# EAGLE design GFB_Basisstation (EAGLE 9.6.2)

## Sheet 1 of 3: Spannungsversorgung / USB
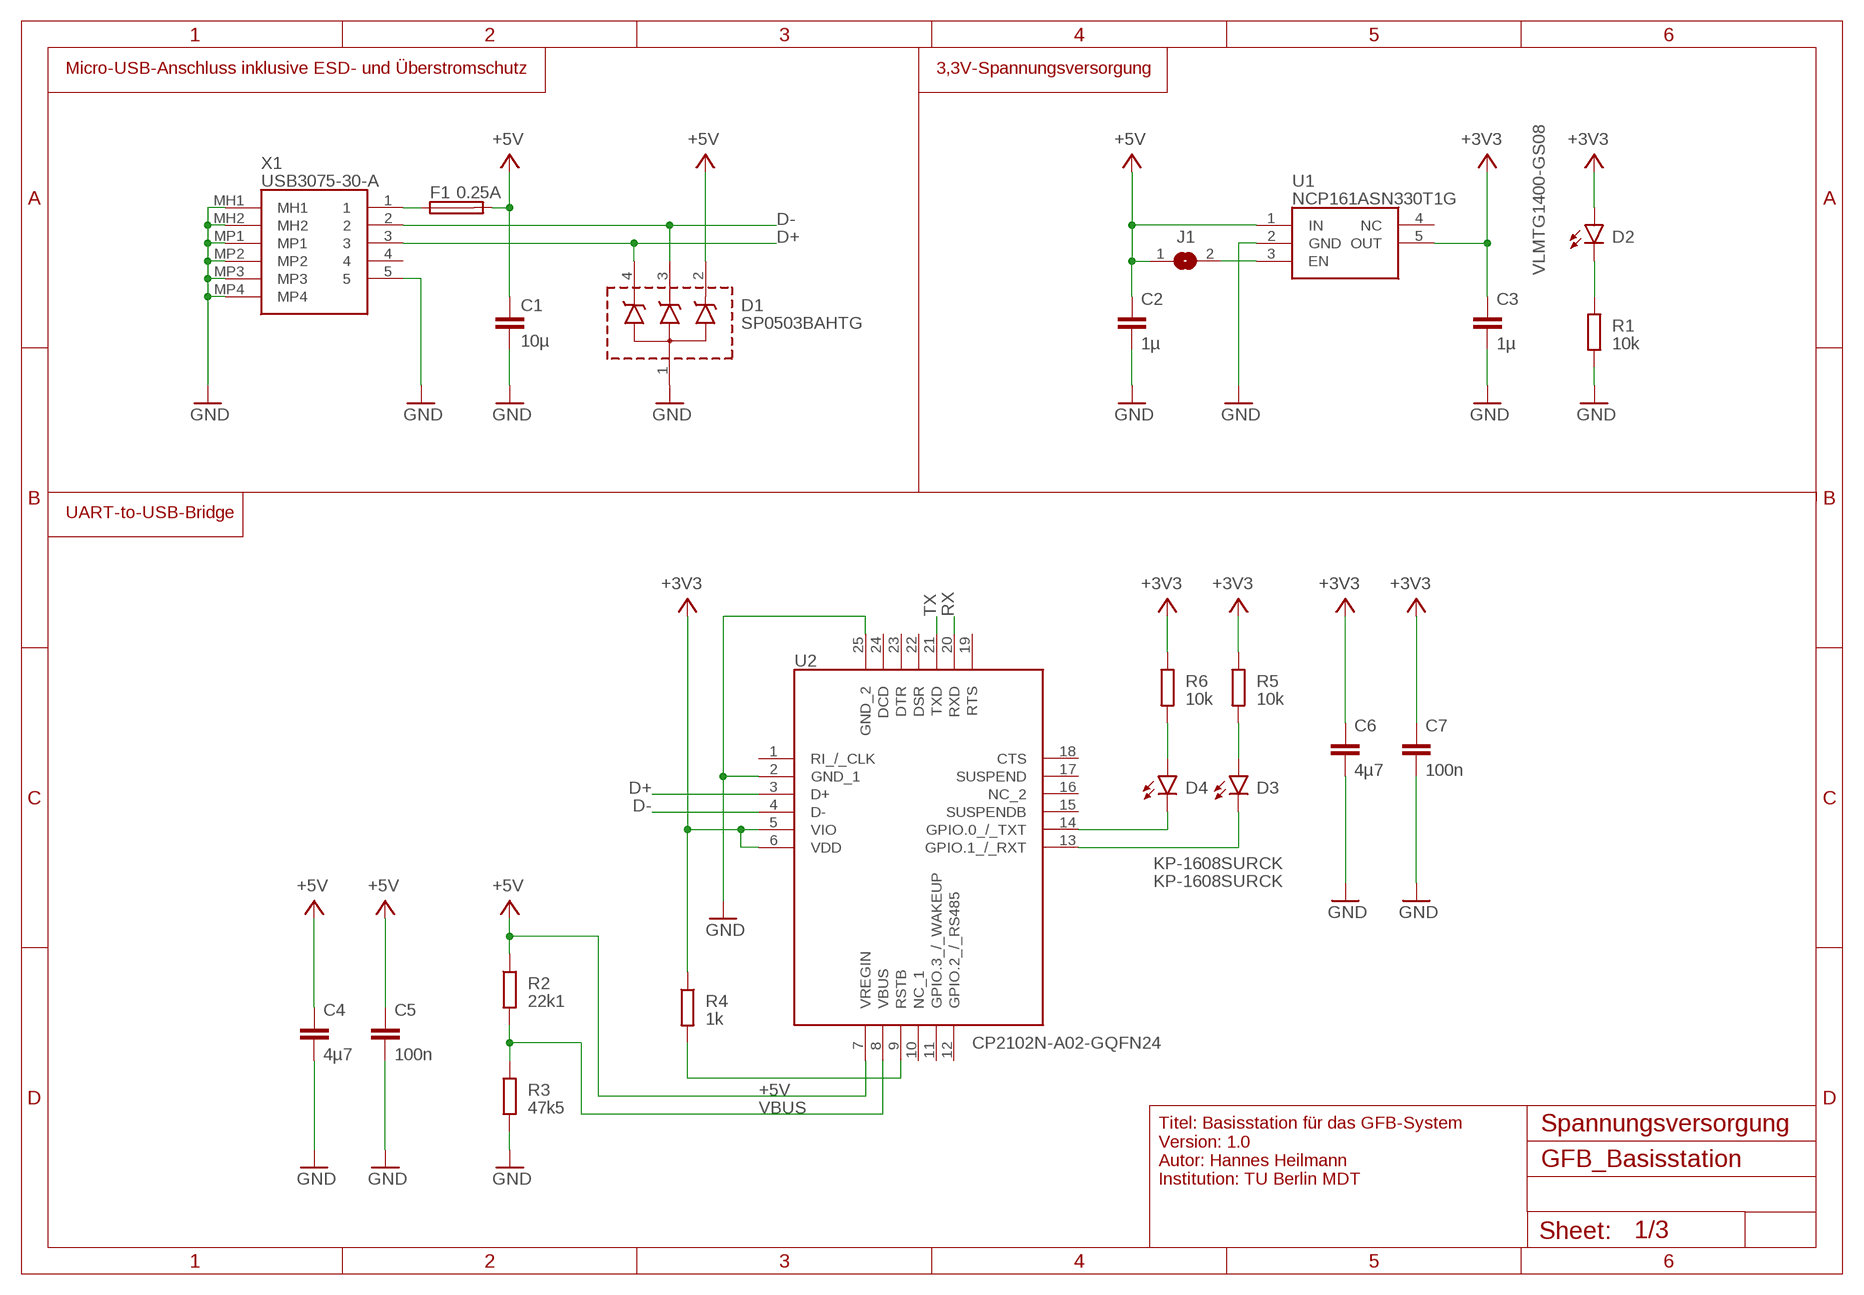
[diagram p0: schematic, sheet 1]

### Parts
C1  10µ  C_OUTLINEC0603_OUTLINE  [PATCHPOLYGRAPHV1_1608M]
C2  1µ  C_OUTLINEC0603_OUTLINE  [PATCHPOLYGRAPHV1_1608M]
C3  1µ  C_OUTLINEC0603_OUTLINE  [PATCHPOLYGRAPHV1_1608M]
C4  4µ7  C_OUTLINEC0603_OUTLINE  [PATCHPOLYGRAPHV1_1608M]
C5  100n  C_OUTLINEC0603_OUTLINE  [PATCHPOLYGRAPHV1_1608M]
C6  4µ7  C_OUTLINEC0603_OUTLINE  [PATCHPOLYGRAPHV1_1608M]
C7  100n  C_OUTLINEC0603_OUTLINE  [PATCHPOLYGRAPHV1_1608M]
D1  SP0503BAHTG  [SP0503BAHTG]
D2  VLMTG1400-GS08  LEDCHIPLED_0603  [CHIPLED_0603]
D3  KP-1608SURCK  LEDCHIPLED_0603  [CHIPLED_0603]
D4  KP-1608SURCK  LEDCHIPLED_0603  [CHIPLED_0603]
F1  SF-0603FP025F-2  [R0603]
J1  SJ  [SJ]
R1  10k  R_OUTLINER0603_OUTLINE  [PATCHPOLYGRAPHV1_1608M]
R2  22k1  R_OUTLINER0603_OUTLINE  [PATCHPOLYGRAPHV1_1608M]
R3  47k5  R_OUTLINER0603_OUTLINE  [PATCHPOLYGRAPHV1_1608M]
R4  1k  R_OUTLINER0603_OUTLINE  [PATCHPOLYGRAPHV1_1608M]
R5  10k  R_OUTLINER0603_OUTLINE  [PATCHPOLYGRAPHV1_1608M]
R6  10k  R_OUTLINER0603_OUTLINE  [PATCHPOLYGRAPHV1_1608M]
U1  NCP161ASN330T1G  [SOT95P280X145-5N]
U2  CP2102N-A02-GQFN24  [QFN50P400X400X80-25N]
X1  USB3075-30-A  [USB307530A]

### Nets
+3V3: C3.1 C6.1 C7.1 D2.A R4.1 R5.1 R6.1 U1.5(OUT) U2.5(VIO) U2.6(VDD) ; also sheet 2,3
+5V: C1.1 C2.1 C4.1 C5.1 D1.2(K_1) F1.2 J1.1 R2.1 U1.1(IN) U2.7(VREGIN)
D+: D1.4(K_3) U2.3(D+) X1.3
D-: D1.3(K_2) U2.4(D-) X1.2
GND: C1.2 C2.2 C3.2 C4.2 C5.2 C6.2 C7.2 D1.1(COMMON_A) R1.2 R3.2 U1.2(GND) U2.2(GND_1) U2.25(GND_2) X1.5 X1.MH1 X1.MH2 X1.MP1 X1.MP2 X1.MP3 X1.MP4 ; also sheet 2,3
N$1: D2.C R1.1
N$2: D3.A R5.2
N$3: R4.2 U2.9(RSTB)
N$5: D4.A R6.2
N$6: F1.1 X1.1
N$8: D3.C U2.13(GPIO.1_/_RXT)
N$9: D4.C U2.14(GPIO.0_/_TXT)
N$10: J1.2 U1.3(EN)
RX: U2.20(RXD) ; also sheet 2
TX: U2.21(TXD) ; also sheet 2
VBUS: R2.2 R3.1 U2.8(VBUS)
Unconnected: U1.4(NC) U2.1(RI_/_CLK) U2.10(NC_1) U2.11(GPIO.3_/_WAKEUP) U2.12(GPIO.2_/_RS485) U2.15(SUSPENDB) U2.16(NC_2) U2.17(SUSPEND) U2.18(CTS) U2.19(RTS) U2.22(DSR) U2.23(DTR) U2.24(DCD) X1.4

### Notes on the sheet
- Micro-USB-Anschluss inklusive ESD- und Überstromschutz | 3,3V-Spannungsversorgung
- 0.25A
- UART-to-USB-Bridge
- Spannungsversorgung
- Titel: Basisstation für das GFB-System
  Version: 1.0
  Autor: Hannes Heilmann
  Institution: TU Berlin MDT

## Sheet 2 of 3: Data-Relay-MCU
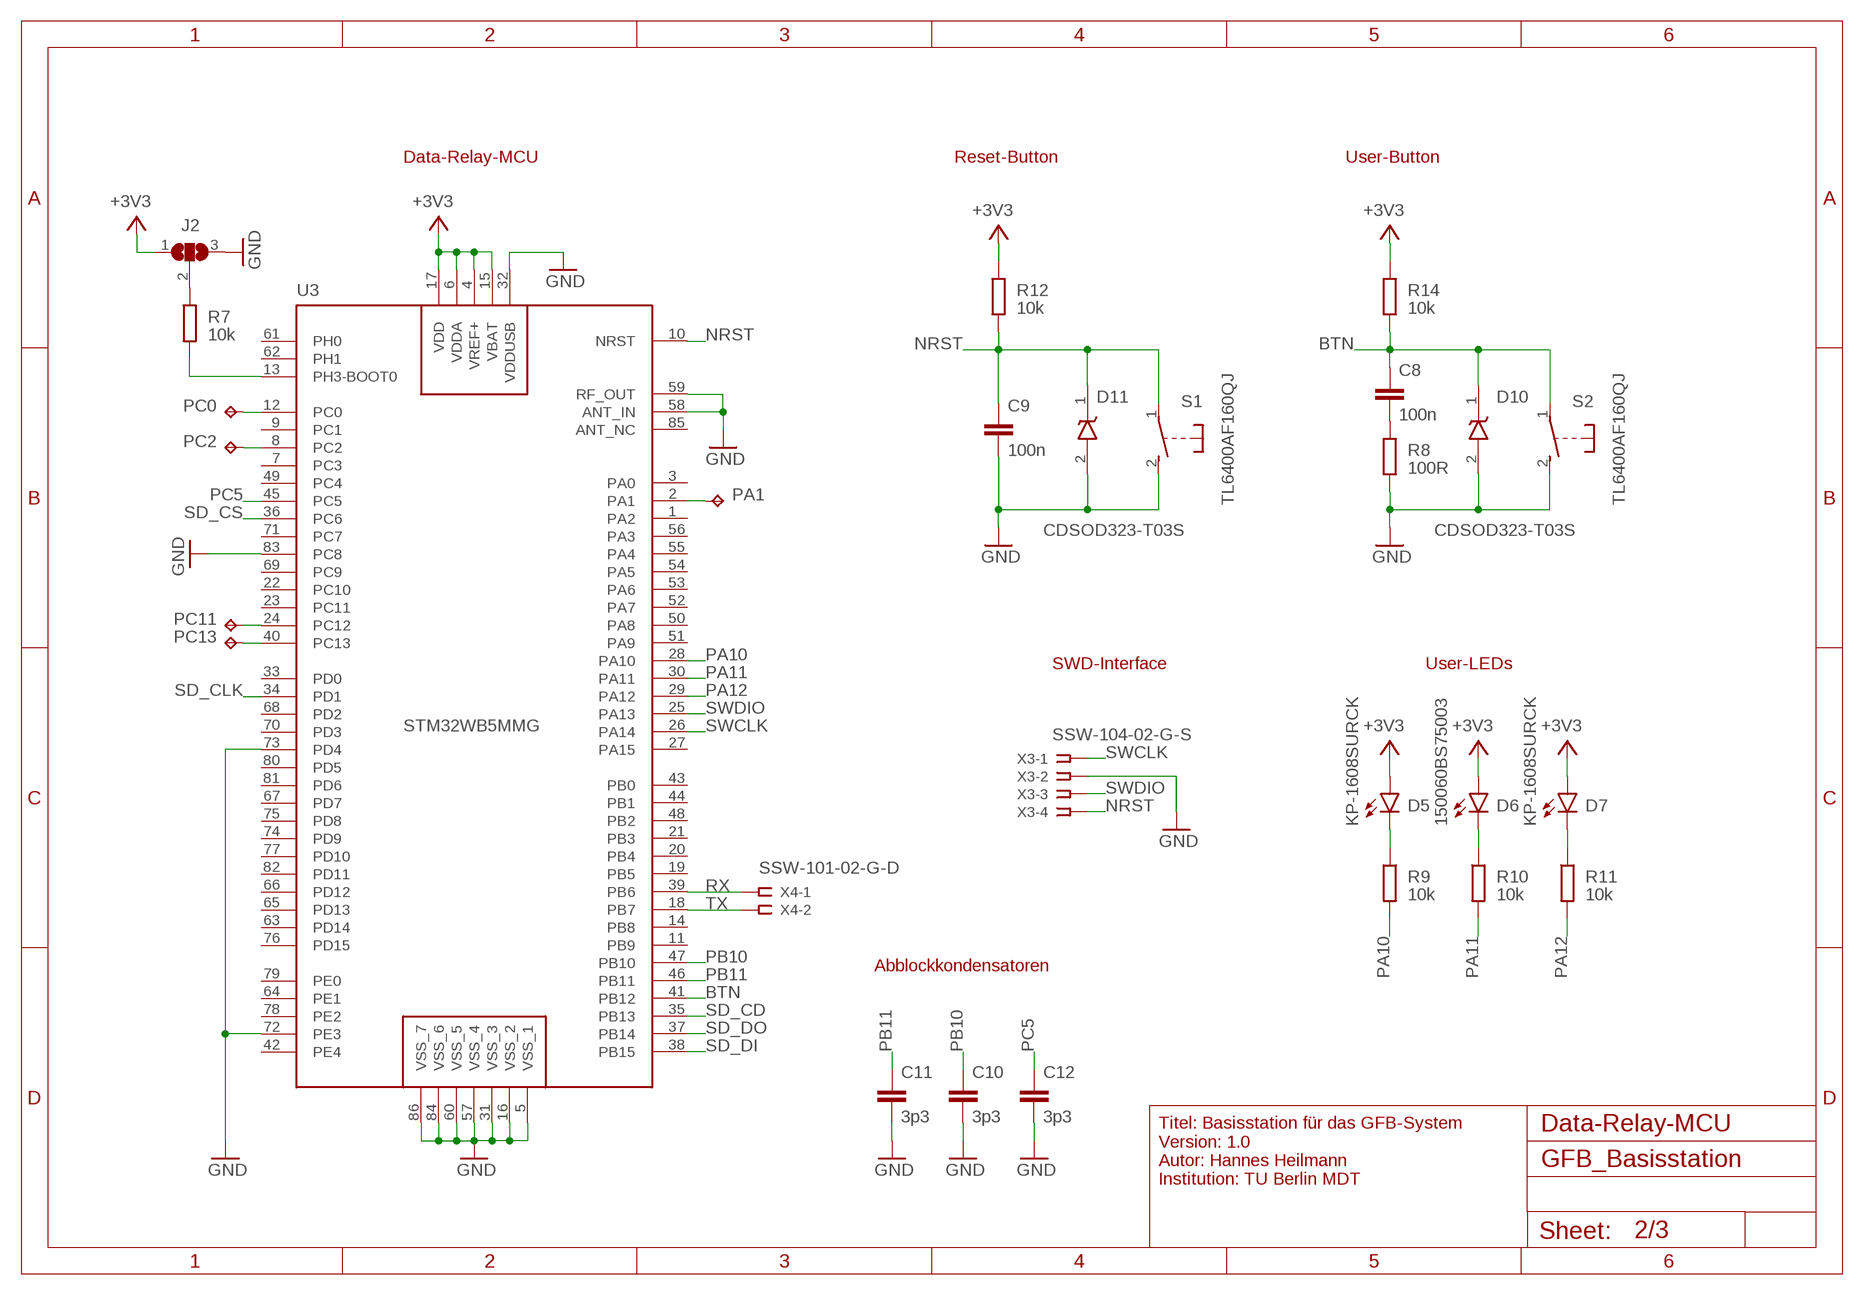
[diagram p1: schematic, sheet 2]

### Parts
C8  100n  C_OUTLINEC0603_OUTLINE  [PATCHPOLYGRAPHV1_1608M]
C9  100n  C_OUTLINEC0603_OUTLINE  [PATCHPOLYGRAPHV1_1608M]
C10  3p3  C_OUTLINEC0603_OUTLINE  [PATCHPOLYGRAPHV1_1608M]
C11  3p3  C_OUTLINEC0603_OUTLINE  [PATCHPOLYGRAPHV1_1608M]
C12  3p3  C_OUTLINEC0603_OUTLINE  [PATCHPOLYGRAPHV1_1608M]
D5  KP-1608SURCK  LEDCHIPLED_0603  [CHIPLED_0603]
D6  150060BS75003  LEDCHIPLED_0603  [CHIPLED_0603]
D7  KP-1608SURCK  LEDCHIPLED_0603  [CHIPLED_0603]
D10  CDSOD323-T03S  [SOD2513X114N]
D11  CDSOD323-T03S  [SOD2513X114N]
J2  JUMPER_3JUMPER_3_0603  [JUMPER_3_0603]
PA1  TPTP06R  [TP06R]
PC0  TPTP06R  [TP06R]
PC2  TPTP06R  [TP06R]
PC11  TPTP06R  [TP06R]
PC13  TPTP06R  [TP06R]
R7  10k  R_OUTLINER0603_OUTLINE  [PATCHPOLYGRAPHV1_1608M]
R8  100R  R_OUTLINER0603_OUTLINE  [PATCHPOLYGRAPHV1_1608M]
R9  10k  R_OUTLINER0603_OUTLINE  [PATCHPOLYGRAPHV1_1608M]
R10  10k  R_OUTLINER0603_OUTLINE  [PATCHPOLYGRAPHV1_1608M]
R11  10k  R_OUTLINER0603_OUTLINE  [PATCHPOLYGRAPHV1_1608M]
R12  10k  R_OUTLINER0603_OUTLINE  [PATCHPOLYGRAPHV1_1608M]
R14  10k  R_OUTLINER0603_OUTLINE  [PATCHPOLYGRAPHV1_1608M]
S1  TL6400AF160QJ  [TL6400AF160QJ]
S2  TL6400AF160QJ  [TL6400AF160QJ]
U3  STM32WB5MMG  [STM32WB5MMG]
X3  SSW-104-02-G-S  [SSW-104-02-G-S]
X4  SSW-101-02-G-D  [SSW-101-02-G-D]

### Nets
+3V3: D5.A D6.A D7.A J2.1 R12.1 R14.1 U3.4(VREF+) U3.6(VDDA) U3.15(VBAT) U3.17(VDD) ; also sheet 1,3
BTN: C8.1 D10.1(K) R14.2 S2.1(P) U3.41(PB12)
GND: C9.2 C10.2 C11.2 C12.2 D10.2(A) D11.2(A) J2.3 R8.2 S1.2(S) S2.2(S) U3.5(VSS_1) U3.16(VSS_2) U3.31(VSS_3) U3.32(VDDUSB) U3.57(VSS_4) U3.58(ANT_IN) U3.59(RF_OUT) U3.60(VSS_5) U3.72(PE3) U3.73(PD4) U3.83(PC8) U3.84(VSS_6) U3.86(VSS_7) X3.2 ; also sheet 1,3
N$7: PC2.TP U3.8(PC2)
N$11: R7.2 U3.13(PH3-BOOT0)
N$13: PC11.TP U3.24(PC12)
N$14: C8.2 R8.1
N$15: D6.C R10.1
N$16: D7.C R11.1
N$17: D5.C R9.1
N$19: PC13.TP U3.40(PC13)
N$20: J2.2 R7.1
N$21: PA1.TP U3.2(PA1)
NRST: C9.1 D11.1(K) R12.2 S1.1(P) U3.10(NRST) X3.4
PA10: R9.2 U3.28(PA10)
PA11: R10.2 U3.30(PA11)
PA12: R11.2 U3.29(PA12)
PB10: C10.1 U3.47(PB10)
PB11: C11.1 U3.46(PB11)
PC0: PC0.TP U3.12(PC0)
PC5: C12.1 U3.45(PC5)
RX: U3.39(PB6) X4.1 ; also sheet 1
SD_CD: U3.35(PB13) ; also sheet 3
SD_CLK: U3.34(PD1) ; also sheet 3
SD_CS: U3.36(PC6) ; also sheet 3
SD_DI: U3.38(PB15) ; also sheet 3
SD_DO: U3.37(PB14) ; also sheet 3
SWCLK: U3.26(PA14) X3.1
SWDIO: U3.25(PA13) X3.3
TX: U3.18(PB7) X4.2 ; also sheet 1
Unconnected: U3.1(PA2) U3.3(PA0) U3.7(PC3) U3.9(PC1) U3.11(PB9) U3.14(PB8) U3.19(PB5) U3.20(PB4) U3.21(PB3) U3.22(PC10) U3.23(PC11) U3.27(PA15) U3.33(PD0) U3.42(PE4) U3.43(PB0) U3.44(PB1) U3.48(PB2) U3.49(PC4) U3.50(PA8) U3.51(PA9) U3.52(PA7) U3.53(PA6) U3.54(PA5) U3.55(PA4) U3.56(PA3) U3.61(PH0) U3.62(PH1) U3.63(PD14) U3.64(PE1) U3.65(PD13) U3.66(PD12) U3.67(PD7) U3.68(PD2) U3.69(PC9) U3.70(PD3) U3.71(PC7) U3.74(PD9) U3.75(PD8) U3.76(PD15) U3.77(PD10) U3.78(PE2) U3.79(PE0) U3.80(PD5) U3.81(PD6) U3.82(PD11) U3.85(ANT_NC)

### Notes on the sheet
- Data-Relay-MCU | Reset-Button | User-Button
- U3
- SWD-Interface | User-LEDs
- STM32WB5MMG
- Abblockkondensatoren
- Data-Relay-MCU
- Titel: Basisstation für das GFB-System
  Version: 1.0
  Autor: Hannes Heilmann
  Institution: TU Berlin MDT

## Sheet 3 of 3: microSD-Karte
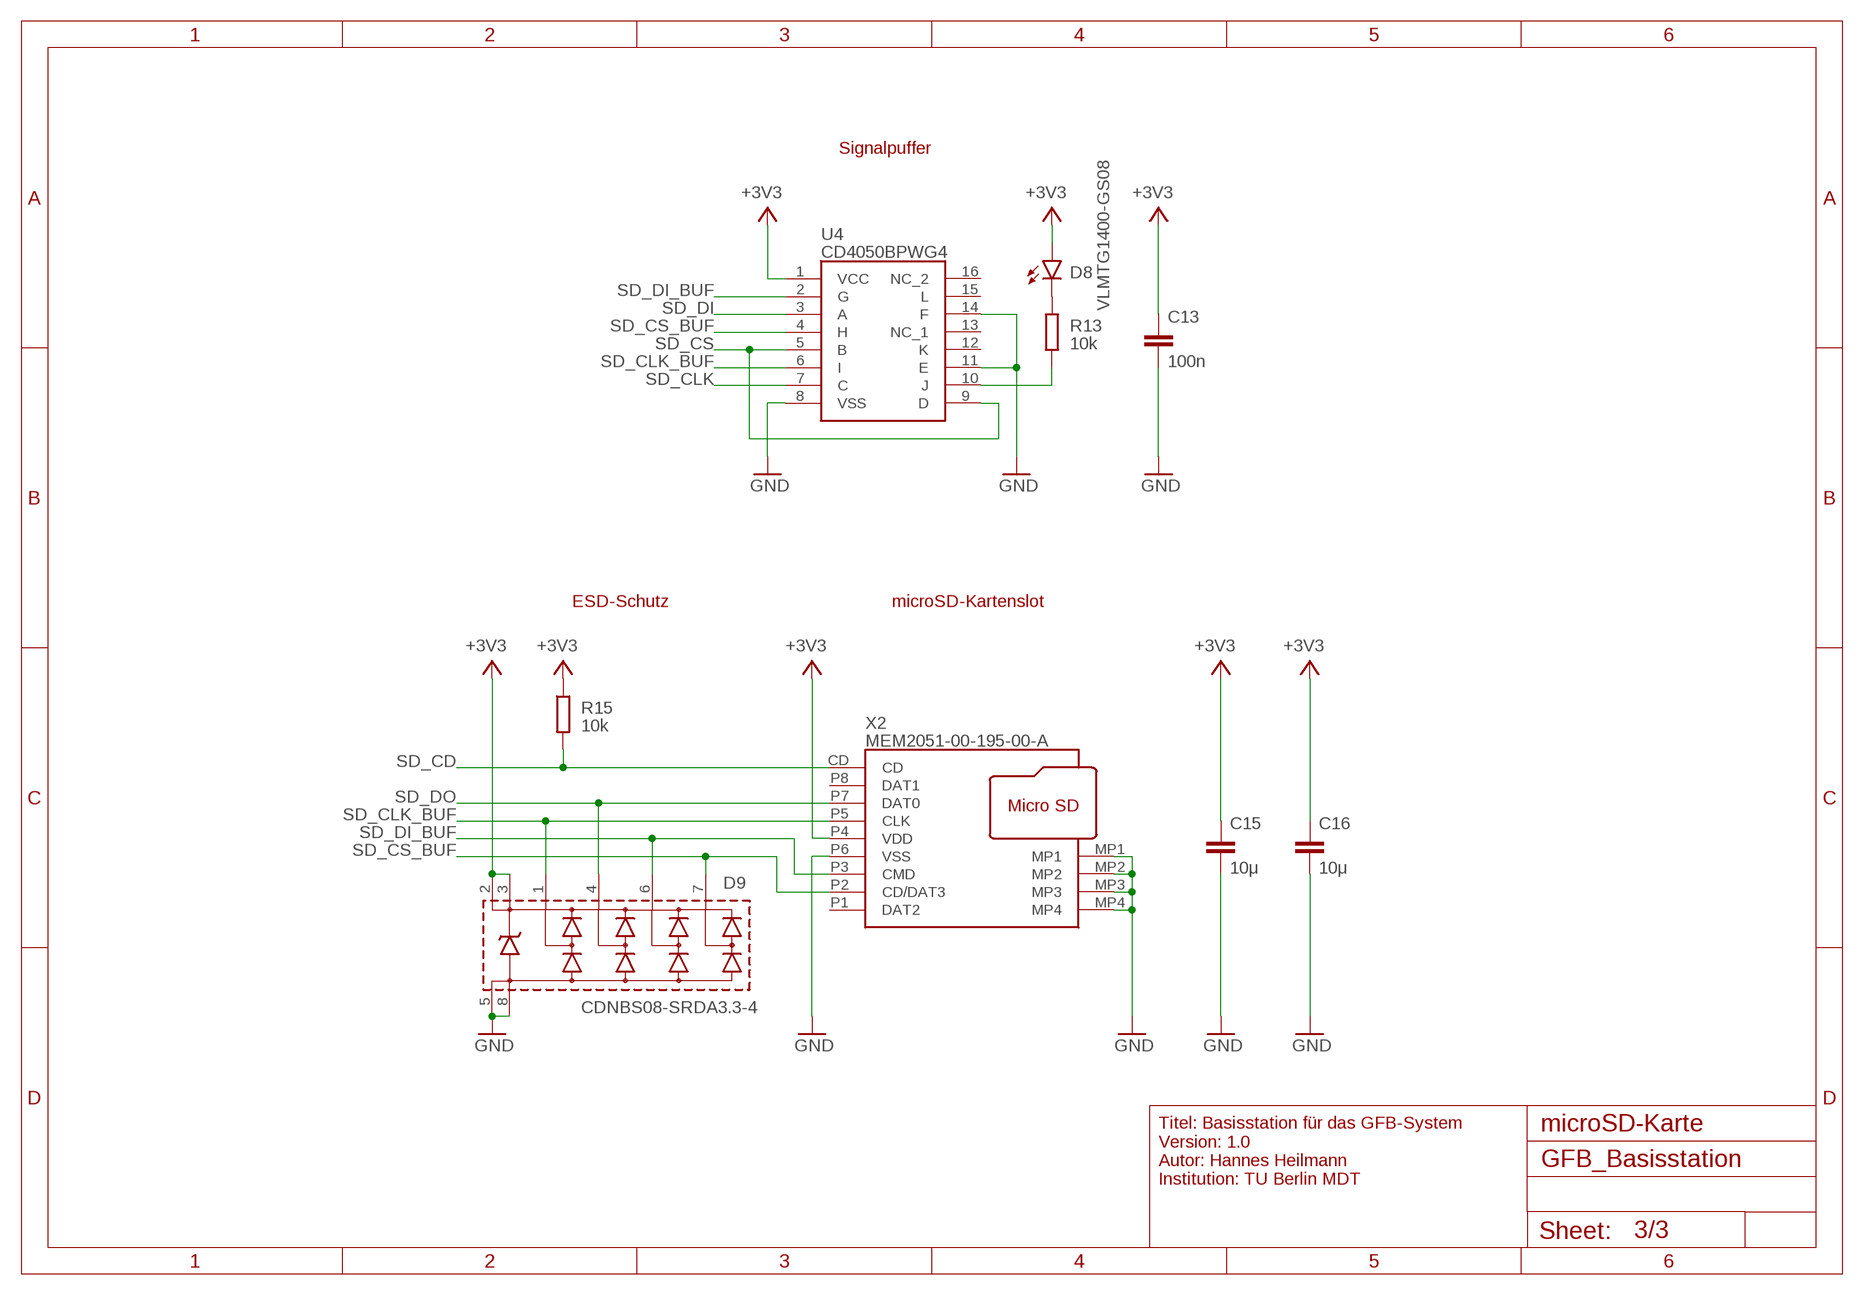
[diagram p2: schematic, sheet 3]

### Parts
C13  100n  C_OUTLINEC0603_OUTLINE  [PATCHPOLYGRAPHV1_1608M]
C15  10μ  C_OUTLINEC0603_OUTLINE  [PATCHPOLYGRAPHV1_1608M]
C16  10μ  C_OUTLINEC0603_OUTLINE  [PATCHPOLYGRAPHV1_1608M]
D8  VLMTG1400-GS08  LEDCHIPLED_0603  [CHIPLED_0603]
D9  CDNBS08-SRDA3.3-4  [SOIC127P600X175-8N]
R13  10k  R_OUTLINER0603_OUTLINE  [PATCHPOLYGRAPHV1_1608M]
R15  10k  R_OUTLINER0603_OUTLINE  [PATCHPOLYGRAPHV1_1608M]
U4  CD4050BPWG4  [SOP65P640X120-16N]
X2  MEM2051-00-195-00-A  [MEM20510019500A]

### Nets
+3V3: C13.1 C15.1 C16.1 D8.A D9.2(+VREF_1) D9.3(+VREF_2) R15.1 U4.1(VCC) X2.P4(VDD) ; also sheet 1,2
GND: C13.2 C15.2 C16.2 D9.5(GND_1) D9.8(GND_2) U4.8(VSS) U4.11(E) U4.14(F) X2.MP1 X2.MP2 X2.MP3 X2.MP4 X2.P6(VSS) ; also sheet 1,2
N$12: R13.2 U4.10(J)
N$18: D8.C R13.1
SD_CD: R15.2 X2.CD ; also sheet 2
SD_CLK: U4.7(C) ; also sheet 2
SD_CLK_BUF: D9.1(I/O_1) U4.6(I) X2.P5(CLK)
SD_CS: U4.5(B) U4.9(D) ; also sheet 2
SD_CS_BUF: D9.7(I/O_4) U4.4(H) X2.P2(CD/DAT3)
SD_DI: U4.3(A) ; also sheet 2
SD_DI_BUF: D9.6(I/O_3) U4.2(G) X2.P3(CMD)
SD_DO: D9.4(I/O_2) X2.P7(DAT0) ; also sheet 2
Unconnected: U4.12(K) U4.13(NC_1) U4.15(L) U4.16(NC_2) X2.P1(DAT2) X2.P8(DAT1)

### Notes on the sheet
- Signalpuffer
- ESD-Schutz | microSD-Kartenslot
- microSD-Karte
- Titel: Basisstation für das GFB-System
  Version: 1.0
  Autor: Hannes Heilmann
  Institution: TU Berlin MDT

## Library data of the parts
C1-C13 C15 C16 = RCL_outlines:C_OUTLINE: CAPACITOR, European symbol
D1 = SamacSys_Parts:SP0503BAHTG: ESD Suppressors / TVS Diodes TVS AVAL DIODE SMT Source: Datasheet <https://nl.mouser.com/datasheet/2/240/Littelfuse_TVS_Diode_Array_SP05_Datasheet.pdf-777043.pdf>; ARROW_PART_NUMBER: SP0503BAHTG; ARROW_PRICE-STOCK: https://www.arrow.com/en/products/sp0503bahtg/littelfuse?region=nac; DESCRIPTION: ESD Suppressors / TVS Diodes TVS AVAL DIODE SMT; HEIGHT: 1.22mm; MANUFACTURER_NAME: LITTELFUSE; MANUFACTURER_PART_NUMBER: SP0503BAHTG; MOUSER_PART_NUMBER: 576-SP0503BAHTG; MOUSER_PRICE-STOCK: https://www.mouser.co.uk/ProductDetail/Littelfuse/SP0503BAHTG?qs=uD%2FdkN7XIa0NTYXwHdELYA%3D%3D
D2-D8 = led:LED: LED OSRAM: - CHIPLED LG R971, LG N971, LY N971, LG Q971, LY Q971, LO R971, LY R971 LH N974, LH R974 LS Q976, LO Q976, LY Q976 LO Q996 - Hyper CHIPLED LW Q18S LB Q993, LB Q99A, LB R99A - SideLED LS A670, LO A670, LY A670, LG A670, LP A670 LB A673, LV A673, LT A673, LW A673 LH A674 LY A675 LS A676, LA A676, LO A676, LY A676, LW A676 LS A679, LY A679, LG A679 - Hyper Micro SIDELED® LS Y876, LA Y876, LO Y876, LY Y876 LT Y87S - SmartLED LW L88C, LW L88S LB L89C, LB L89S, LG L890 LS L89K, LO L89K, LY L89K LS L896, LA L896, LO L896, LY L896 - TOPLED LS T670, LO T670, LY T670, LG T670, LP T670 LSG T670, LSP T670, LSY T670, LOP T670, LYG T670 LG T671, LOG T671, LSG T671 LB T673, LV T673, LT T673, LW T673 LH T674 LS T676, LA T676, LO T676, LY T676, LB T676, LH T676, LSB T676, LW T676 LB T67C, LV T67C, LT T67C, LS T67K, LO T67K, LY T67K, LW E67C LS E67B, LA E67B, LO E67B, LY E67B, LB E67C, LV E67C, LT E67C LW T67C LS T679, LY T679, LG T679 LS T770, LO T770, LY T770, LG T770, LP T770 LB T773, LV T773, LT T773, LW T773 LH T774 LS E675, LA E675, LY E675, LS T675 LS T776, LA T776, LO T776, LY T776, LB T776 LHGB T686 LT T68C, LB T68C - Hyper Mini TOPLED® LB M676 - Mini TOPLED Santana® LG M470 LS M47K, LO M47K, LY M47K Source: http://www.osram.convergy.de LUXEON: - LUMILED® LXK2-PW12-R00, LXK2-PW12-S00, LXK2-PW14-U00, LXK2-PW14-V00 LXK2-PM12-R00, LXK2-PM12-S00, LXK2-PM14-U00 LXK2-PE12-Q00, LXK2-PE12-R00, LXK2-PE12-S00, LXK2-PE14-T00, LXK2-PE14-U00 LXK2-PB12-K00, LXK2-PB12-L00, LXK2-PB12-M00, LXK2-PB14-N00, LXK2-PB14-P00, LXK2-PB14-Q00 LXK2-PR12-L00, LXK2-PR12-M00, LXK2-PR14-Q00, LXK2-PR14-R00 LXK2-PD12-Q00, LXK2-PD12-R00, LXK2-PD12-S00 LXK2-PH12-R00, LXK2-PH12-S00 LXK2-PL12-P00, LXK2-PL12-Q00, LXK2-PL12-R00 Source: www.luxeon.com KINGBRIGHT: KA-3528ASYC Source: www.kingbright.com
D9 = SamacSys_Parts:CDNBS08-SRDA3.3-4: Bourns CDNBS08-SRDA3.3-4, 9-Element Uni-Directional TVS Diode Array, 500W, 8-Pin SOIC Source: Datasheet <https://www.bourns.com/data/global/pdfs/CDNBS08_SRDAxx_4.pdf>; ARROW_PART_NUMBER: CDNBS08-SRDA3.3-4; ARROW_PRICE-STOCK: https://www.arrow.com/en/products/cdnbs08-srda3.3-4/bourns?region=nac; DESCRIPTION: Bourns CDNBS08-SRDA3.3-4, 9-Element Uni-Directional TVS Diode Array, 500W, 8-Pin SOIC; HEIGHT: 1.75mm; MANUFACTURER_NAME: Bourns; MANUFACTURER_PART_NUMBER: CDNBS08-SRDA3.3-4; MOUSER_PART_NUMBER: 652-CDNBS08SRDA3.3-4; MOUSER_PRICE-STOCK: https://www.mouser.co.uk/ProductDetail/Bourns/CDNBS08-SRDA3.3-4?qs=y169g2bsK9qTnGqJ5TKj%252Bw%3D%3D
D10 D11 = SamacSys_Parts:CDSOD323-T03S: ESD Suppressors / TVS Diodes Unidirectional Std Cap Source: Datasheet <https://datasheet.datasheetarchive.com/originals/dk/DKDS-12/224732.pdf>; ARROW_PART_NUMBER: CDSOD323-T03S; ARROW_PRICE-STOCK: https://www.arrow.com/en/products/cdsod323-t03s/bourns?region=nac; DESCRIPTION: ESD Suppressors / TVS Diodes Unidirectional Std Cap; HEIGHT: 1.14mm; MANUFACTURER_NAME: Bourns; MANUFACTURER_PART_NUMBER: CDSOD323-T03S; MOUSER_PART_NUMBER: 652-CDSOD323-T03S; MOUSER_PRICE-STOCK: https://www.mouser.co.uk/ProductDetail/Bourns/CDSOD323-T03S?qs=6S5Watp5UnKvHMaJwkOReA%3D%3D
F1 = GFB_Sensorsystem:SF-0603FP025F-2
J1 = jumper:SJ: SMD solder JUMPER
J2 = GFB_Sensorsystem:JUMPER_3
PA1 PC0 PC2 PC11 PC13 = testpad:TP: Test pad
R1-R15 = RCL_outlines:R_OUTLINE: RESISTOR, European symbol
S1 S2 = SamacSys_Parts:TL6400AF160QJ: Tactile Switch SPST-NO Top Actuated Surface Mount Source: Datasheet <https://sten-eswitch-13110800-production.s3.amazonaws.com/system/asset/product_line/data_sheet/178/TL6700.pdf>; DESCRIPTION: Tactile Switch SPST-NO Top Actuated Surface Mount; HEIGHT: 4.3mm; MANUFACTURER_NAME: E-Switch; MANUFACTURER_PART_NUMBER: TL6400AF160QJ; MOUSER_PART_NUMBER: 612-TL6400AF160QJ; MOUSER_PRICE-STOCK: https://www.mouser.co.uk/ProductDetail/E-Switch/TL6400AF160QJ?qs=t7xnP681wgXh9NC1jPxNOA%3D%3D
U1 = SamacSys_Parts:NCP161ASN330T1G: ON SEMICONDUCTOR - NCP161ASN330T1G - Fixed LDO Voltage Regulator, 1.9V to 5.5V, 225mV drop, 3.3V/450mA out, SOT-23-5 Source: Datasheet <https://componentsearchengine.com/Datasheets/2/NCP161ASN330T1G.pdf>; ARROW_PART_NUMBER: NCP161ASN330T1G; ARROW_PRICE-STOCK: https://www.arrow.com/en/products/ncp161asn330t1g/on-semiconductor?region=nac; DESCRIPTION: ON SEMICONDUCTOR - NCP161ASN330T1G - Fixed LDO Voltage Regulator, 1.9V to 5.5V, 225mV drop, 3.3V/450mA out, SOT-23-5; HEIGHT: 1.45mm; MANUFACTURER_NAME: onsemi; MANUFACTURER_PART_NUMBER: NCP161ASN330T1G; MOUSER_PART_NUMBER: 863-NCP161ASN330T1G; MOUSER_PRICE-STOCK: https://www.mouser.co.uk/ProductDetail/onsemi/NCP161ASN330T1G?qs=vLWxofP3U2ze5zA%252BHmAd3w%3D%3D
U2 = SamacSys_Parts:CP2102N-A02-GQFN24: USB Interface IC USB to UART bridge - QFN24 Source: Datasheet <https://componentsearchengine.com/Datasheets/1/CP2102N-A02-GQFN24.pdf>; ARROW_PART_NUMBER: CP2102N-A02-GQFN24; ARROW_PRICE-STOCK: https://www.arrow.com/en/products/cp2102n-a02-gqfn24/silicon-labs; DESCRIPTION: USB Interface IC USB to UART bridge - QFN24; HEIGHT: 0.8mm; MANUFACTURER_NAME: Silicon Labs; MANUFACTURER_PART_NUMBER: CP2102N-A02-GQFN24; MOUSER_PART_NUMBER: 634-CP2102NA02GQFN24; MOUSER_PRICE-STOCK: https://www.mouser.co.uk/ProductDetail/Silicon-Labs/CP2102N-A02-GQFN24?qs=u16ybLDytRYKabtL%2FE7DZA%3D%3D
U3 = GFB_Sensorsystem:STM32WB5MMG
U4 = SamacSys_Parts:CD4050BPWG4: IC BUFF/CONVERTER HEX 16TSSOP Source: Datasheet <http://www.ti.com/lit/ds/symlink/cd4049ub.pdf>; DESCRIPTION: IC BUFF/CONVERTER HEX 16TSSOP; HEIGHT: 1.2mm; MANUFACTURER_NAME: Texas Instruments; MANUFACTURER_PART_NUMBER: CD4050BPWG4; MOUSER_PART_NUMBER: 595-CD4050BPWG4; MOUSER_PRICE-STOCK: https://www.mouser.co.uk/ProductDetail/Texas-Instruments/CD4050BPWG4?qs=R%252BdApFK7ZT3v%252Blc0ryPOpg%3D%3D
X1 = SamacSys_Parts:USB3075-30-A: GCT (GLOBAL CONNECTOR TECHNOLOGY) - USB3075-30-A - USB Connector, Micro USB Type B, USB 2.0, Receptacle, 5 Ways, Surface Mount, Right Angle Source: Datasheet <https://componentsearchengine.com/Datasheets/2/USB3075-30-A.pdf>; DESCRIPTION: GCT (GLOBAL CONNECTOR TECHNOLOGY) - USB3075-30-A - USB Connector, Micro USB Type B, USB 2.0, Receptacle, 5 Ways, Surface Mount, Right Angle; HEIGHT: 2.7mm; MANUFACTURER_NAME: GCT (GLOBAL CONNECTOR TECHNOLOGY); MANUFACTURER_PART_NUMBER: USB3075-30-A; MOUSER_PART_NUMBER: 640-USB3075-30-A; MOUSER_PRICE-STOCK: https://www.mouser.co.uk/ProductDetail/GCT/USB3075-30-A?qs=KUoIvG%2F9IlbGMJplbp1ybA%3D%3D
X2 = GFB_Sensorsystem:MEM2051-00-195-00-A: MICRO SD PUSH PUSH, OPEN, SMT, 1 Source: Datasheet <https://gct.co/files/drawings/mem2051.pdf>; DESCRIPTION: MICRO SD PUSH PUSH, OPEN, SMT, 1; HEIGHT: 2.05mm; MANUFACTURER_NAME: GCT (GLOBAL CONNECTOR TECHNOLOGY); MANUFACTURER_PART_NUMBER: MEM2051-00-195-00-A; MOUSER_PART_NUMBER: 640-MEM20510019500A; MOUSER_PRICE-STOCK: https://www.mouser.co.uk/ProductDetail/GCT/MEM2051-00-195-00-A?qs=KUoIvG%2F9Ilat7yfJRNWXUQ%3D%3D
X3 = GFB_Sensorsystem:SSW-104-02-G-S: THROUGH-HOLE .025" SQ POST SOCKET Source: Samtec SSW.pdf; MF: Samtec Inc.; MPN: SSW-104-02-G-S; OC_FARNELL: unknown; OC_NEWARK: 11P9384
X4 = GFB_Sensorsystem:SSW-101-02-G: THROUGH-HOLE .025" SQ POST SOCKET Source: Samtec SSW.pdf; MF: Samtec Inc.; MPN: SSW-101-02-G-D; OC_FARNELL: unknown; OC_NEWARK: 82P1456

## Board
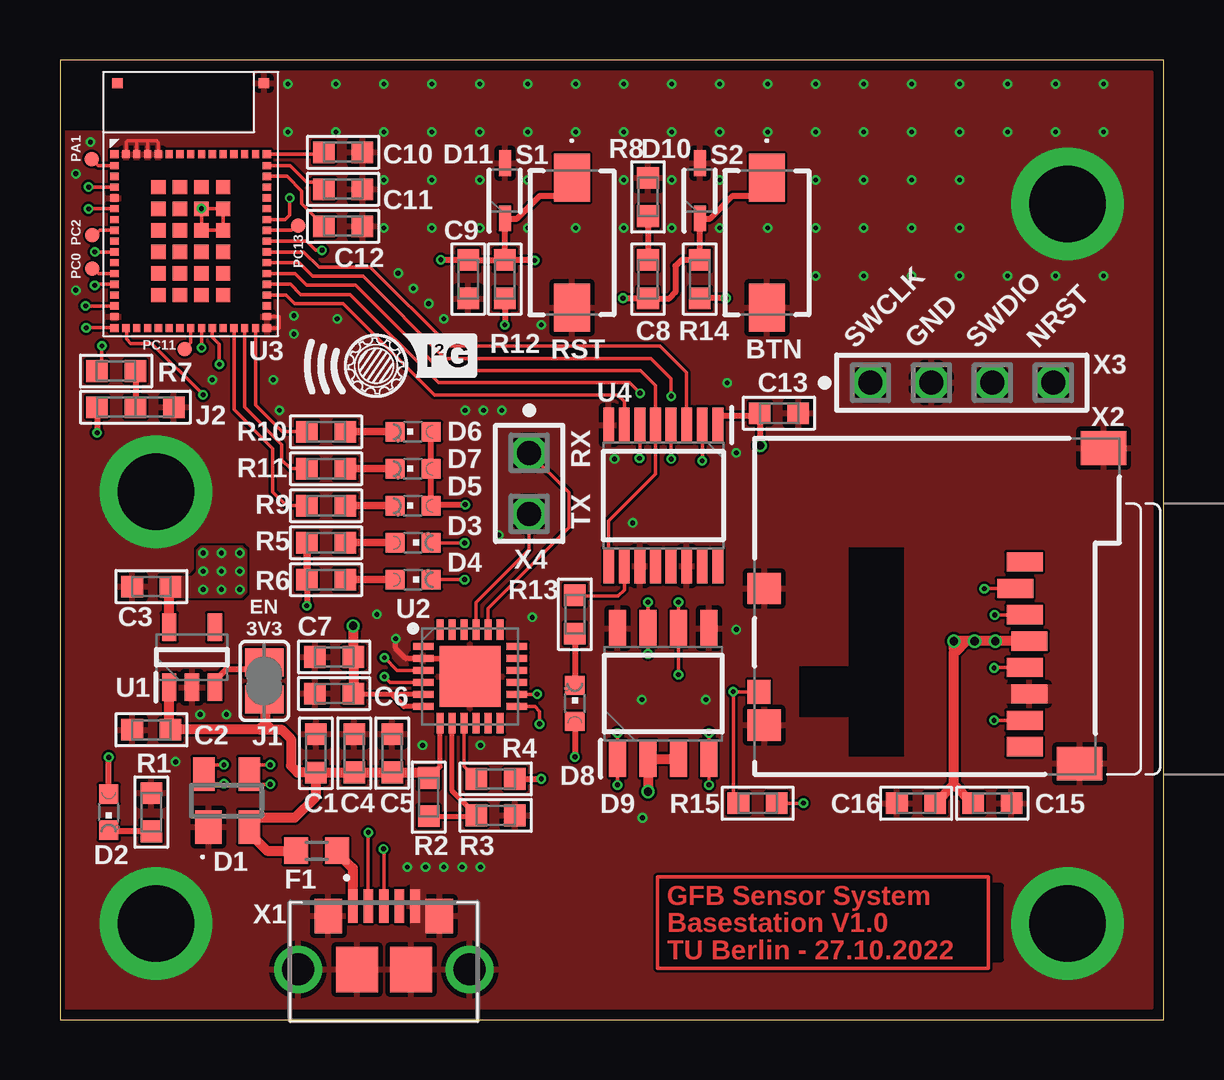
[diagram p3: board, top side]
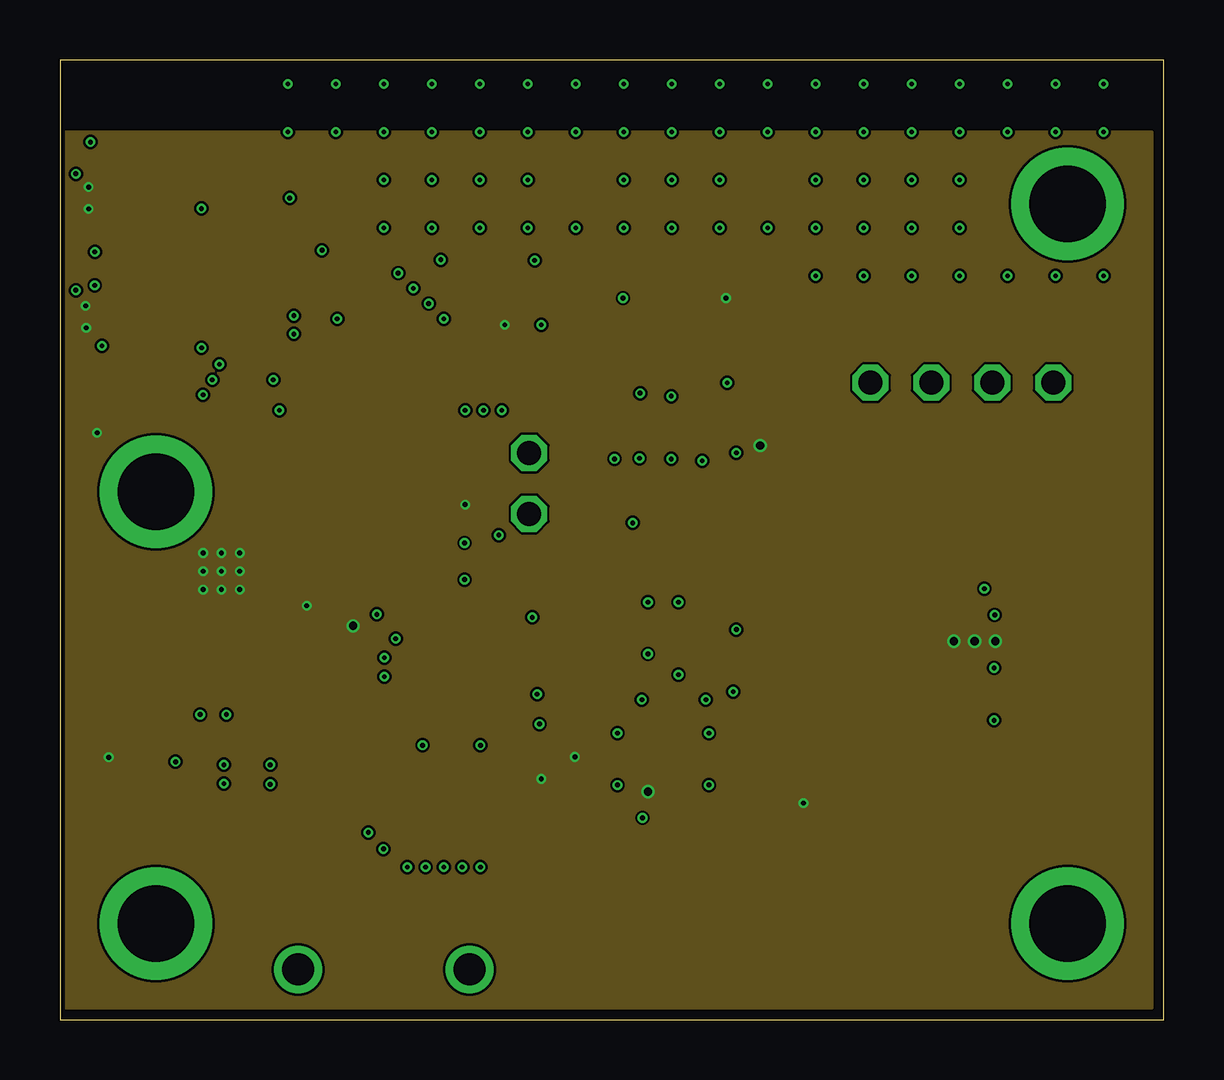
[diagram p4: board, inner layer Route2]
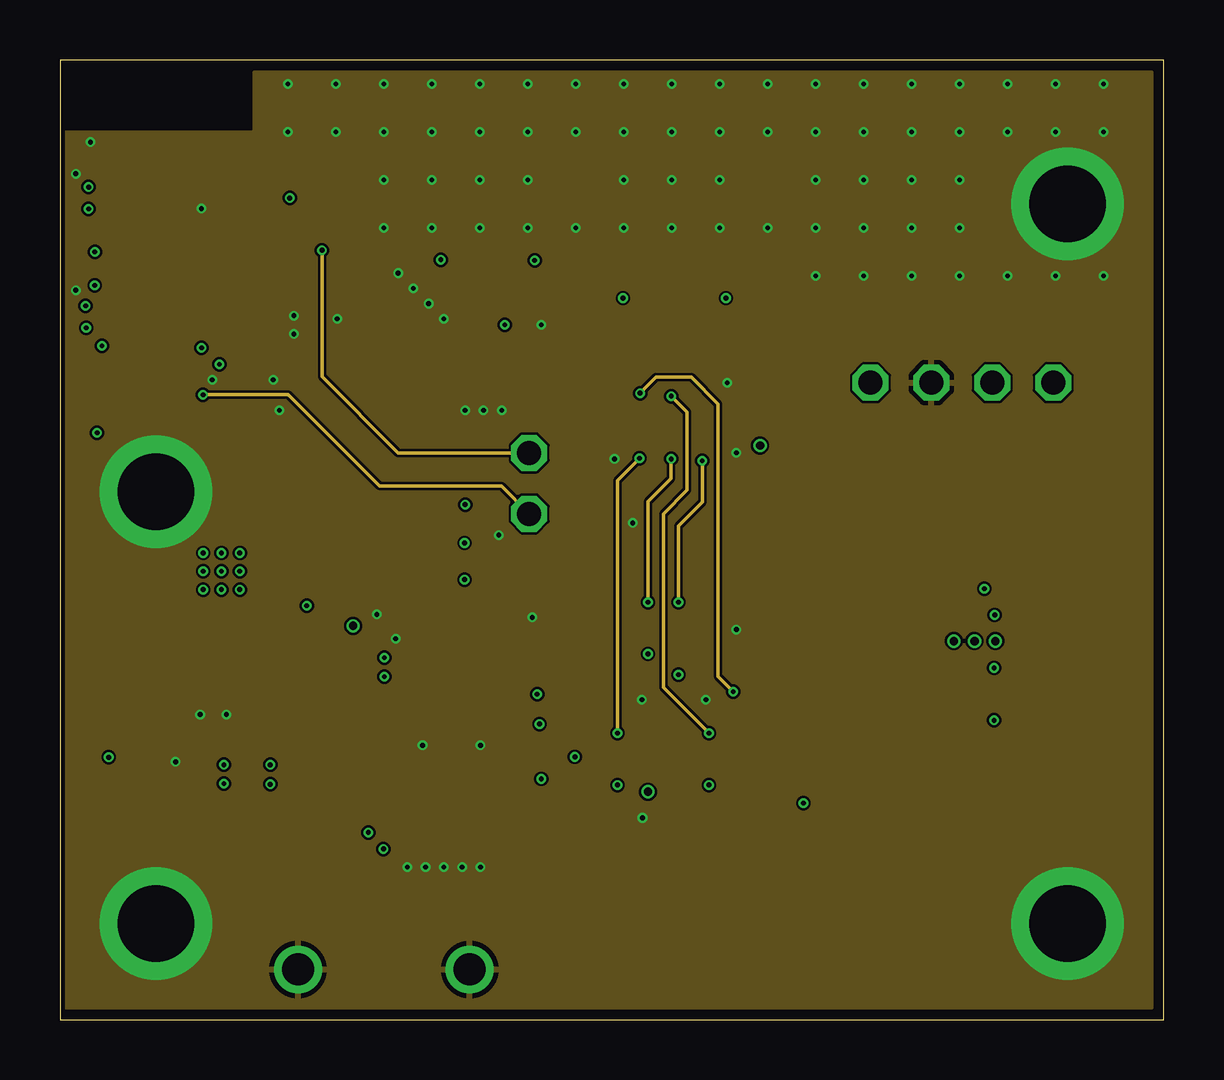
[diagram p5: board, inner layer Route3]
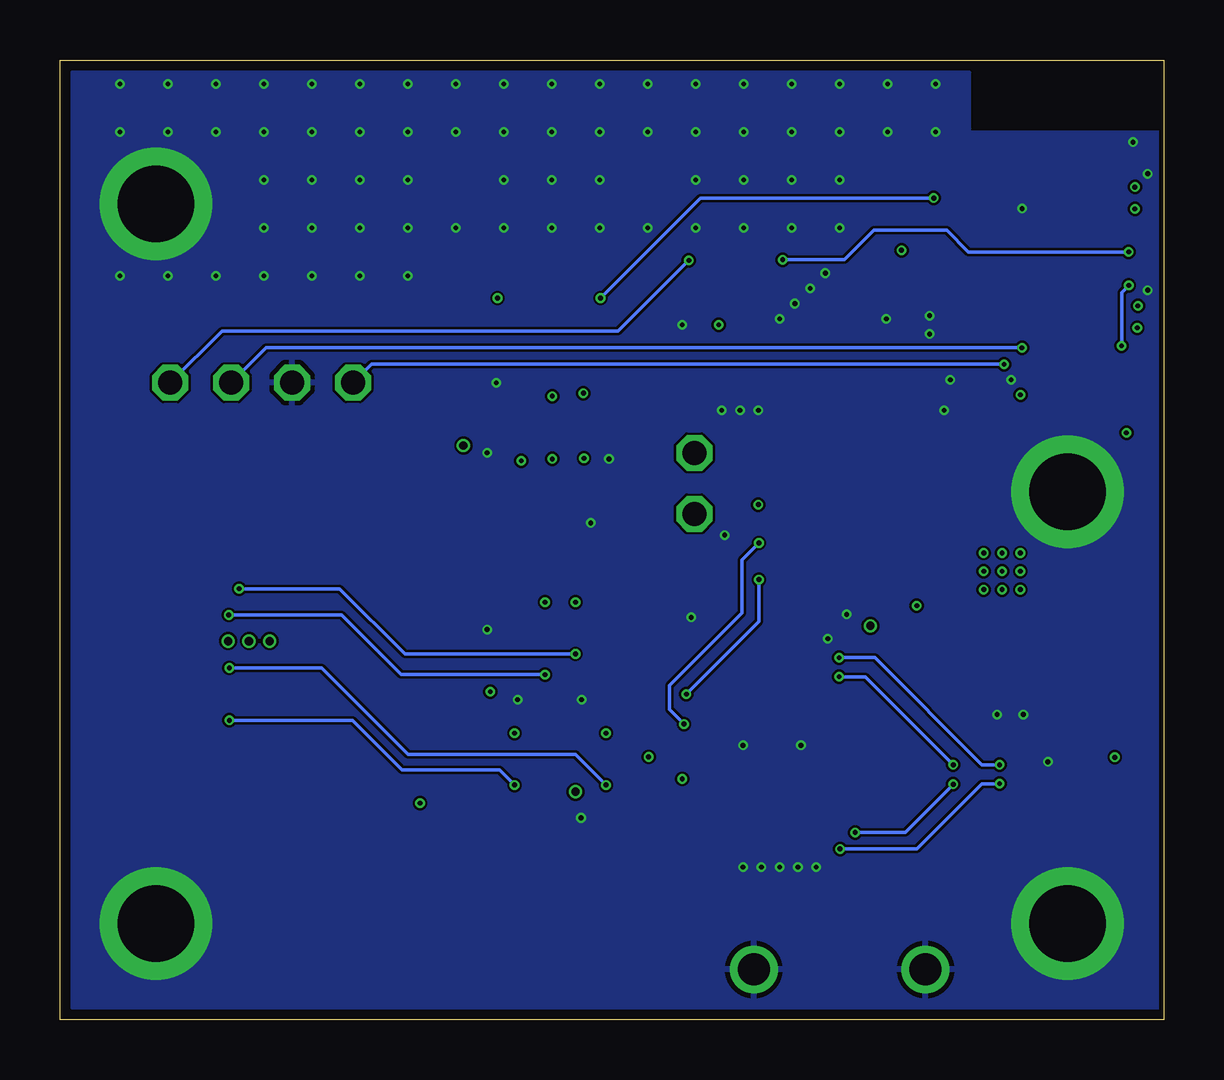
[diagram p6: board, bottom side, seen from below]

Size 46 x 40 mm. Coordinates in mm from the lower left corner, seen from the top.
Outline: 0,0 46,0 46,40 0,40 0,0
Copper layers (1+2*3+16): Top 0.018mm / dielectric 0.36mm / Route2 0.035mm / dielectric 0.71mm / Route3 0.035mm / dielectric 0.36mm / Bottom 0.018mm
Design rules "Multi-CB_4L_100µm-Tracks_OL35µm-IL35µm *": minimum track width 0.1mm, minimum drill 0.2mm, track to track 0.1mm, track to pad 0.1mm, pad to pad 0.1mm, via to via 0.1mm, smd to smd 0mil, copper to edge 0.2mm, drill to drill 0.2mm, minimum pad ring 0.125mm, minimum via ring 0.1mm, stop-mask expansion 2mil, vias tented up to drill 0mil, thermal gap 0.2mm

### Footprints (pad centres in the part's own frame; a part is rotated, then mirrored left to right if it is on the bottom)
PATCHPOLYGRAPHV1_1608M = smd 0.9 x 0.9: 1 -0.8,0; 2 0.8,0
SP0503BAHTG = smd 1.1 x 1.4: 1 -0.75,-1.1 | smd 0.9 x 1.4: 2 0.95,-1.1; 3 0.95,1.1; 4 -0.95,1.1
CHIPLED_0603 = smd 0.8 x 0.8: A 0,-0.75; C 0,0.75
SOIC127P600X175-8N = smd 1.522 x 0.7: 1 -2.714,1.905; 2 -2.714,0.635; 3 -2.714,-0.635; 4 -2.714,-1.905; 5 2.714,-1.905; 6 2.714,-0.635; 7 2.714,0.635; 8 2.714,1.905
SOD2513X114N = smd 1.075 x 0.5: 1 -1.15,0; 2 1.15,0
R0603 = smd 1 x 1.1: 1 -0.85,0; 2 0.85,0
SJ = smd 1.168 x 1.6: 1 -0.762,0; 2 0.762,0
JUMPER_3_0603 = smd 0.9 x 0.9: 1 -1.6,0; 2 0,0; 3 1.6,0
TP06R = smd 0.6 x 0.6: TP 0,0
TL6400AF160QJ = smd 2 x 1.5: 1 -2.7,0; 2 2.7,0
SOT95P280X145-5N = smd 1.15 x 0.6: 1 -1.25,0.95; 2 -1.25,0; 3 -1.25,-0.95; 4 1.25,-0.95; 5 1.25,0.95
QFN50P400X400X80-25N = smd 0.85 x 0.3: 1 -1.95,1.25; 2 -1.95,0.75; 3 -1.95,0.25; 4 -1.95,-0.25; 5 -1.95,-0.75; 6 -1.95,-1.25; 13 1.95,-1.25; 14 1.95,-0.75; 15 1.95,-0.25; 16 1.95,0.25; 17 1.95,0.75; 18 1.95,1.25 | smd 0.3 x 0.85: 7 -1.25,-1.95; 8 -0.75,-1.95; 9 -0.25,-1.95; 10 0.25,-1.95; 11 0.75,-1.95; 12 1.25,-1.95; 19 1.25,1.95; 20 0.75,1.95; 21 0.25,1.95; 22 -0.25,1.95; 23 -0.75,1.95; 24 -1.25,1.95 | smd 2.55 x 2.55: 25 0,0
STM32WB5MMG = smd 0.35 x 0.35: 1 0.475,7.575; 17 0.475,0.325; 31 6.825,0.325; 47 6.825,7.575 | smd 0.35 x 0.3: 2 0.476,7.1; 3 0.475,6.65; 4 0.475,6.2; 5 0.475,5.75; 6 0.475,5.3; 7 0.475,4.85; 8 0.475,4.4; 9 0.475,3.95; 10 0.475,3.5; 11 0.475,3.05; 12 0.475,2.6; 13 0.475,2.15; 14 0.475,1.7; 15 0.475,1.25; 16 0.475,0.8; 32 6.825,0.8; 33 6.825,1.25; 34 6.825,1.7; 35 6.825,2.15; 36 6.825,2.6; 37 6.825,3.05; 38 6.825,3.5; 39 6.825,3.95; 40 6.825,4.4; 41 6.825,4.85; 42 6.825,5.3; 43 6.825,5.75; 44 6.825,6.2; 45 6.825,6.65; 46 6.825,7.1 | smd 0.3 x 0.35: 18 0.95,0.325; 19 1.4,0.325; 20 1.85,0.325; 21 2.3,0.325; 22 2.75,0.325; 23 3.2,0.325; 24 3.65,0.325; 25 4.1,0.325; 26 4.55,0.325; 27 5,0.325; 28 5.45,0.325; 29 5.9,0.325; 30 6.35,0.325; 48 6.35,7.575; 49 5.9,7.575; 50 5.45,7.575; 51 5,7.575; 52 4.55,7.575; 53 4.1,7.575; 54 3.65,7.575; 55 3.2,7.575; 56 2.75,7.575; 57 2.3,7.575; 58 1.85,7.575; 59 1.4,7.575; 60 0.95,7.575 | smd 0.6 x 0.6: 61 2.3,6.2; 62 2.3,5.3; 63 2.3,4.4; 64 2.3,3.5; 65 2.3,2.6; 66 2.3,1.7; 67 3.2,1.7; 68 4.1,1.7; 69 5,1.7; 70 5,2.6; 71 5,3.5; 72 5,4.4; 73 5,5.3; 74 5,6.2; 75 4.1,6.2; 76 3.2,6.2; 77 3.2,5.3; 78 3.2,4.4; 79 3.2,3.5; 80 3.2,2.6; 81 4.1,2.6; 82 4.1,3.5; 83 4.1,4.4; 84 4.1,5.3 | smd 0.43 x 0.43: 85 0.6,10.535; 86 6.7,10.535
SOP65P640X120-16N = smd 1.475 x 0.45: 1 -2.938,2.275; 2 -2.938,1.625; 3 -2.938,0.975; 4 -2.938,0.325; 5 -2.938,-0.325; 6 -2.938,-0.975; 7 -2.938,-1.625; 8 -2.938,-2.275; 9 2.938,-2.275; 10 2.938,-1.625; 11 2.938,-0.975; 12 2.938,-0.325; 13 2.938,0.325; 14 2.938,0.975; 15 2.938,1.625; 16 2.938,2.275
USB307530A = smd 0.4 x 1.4: 1 -1.3,2.65; 2 -0.65,2.65; 3 0,2.65; 4 0.65,2.65; 5 1.3,2.65 | drill 1.329 pad 1.85: MH1 -3.575,0; MH2 3.575,0 | smd 1.75 x 1.9: MP1 -1.125,0; MP2 1.125,0 | smd 1.15 x 1.45: MP3 -2.32,2.23; MP4 2.32,2.23
MEM20510019500A = smd 1 x 0.95: CD 3.44,-0.175 | smd 1.3 x 1.4: MP1 2.05,-0.4; MP2 7.75,-0.4 | smd 1.4 x 1.9: MP3 0.45,-13.55; MP4 13.6,-14.55 | smd 0.8 x 1.5: P1 8.85,-11.26; P2 7.75,-10.86; P3 6.65,-11.26; P4 5.55,-11.46; P5 4.45,-11.26; P6 3.35,-11.46; P7 2.25,-11.26; P8 1.15,-11.26
SSW-104-02-G-S = drill 1 pad 1.5 octagon: 1 -3.81,0; 2 -1.27,0; 3 1.27,0; 4 3.81,0
SSW-101-02-G-D = drill 1 pad 1.5 octagon: 1 0,-1.27; 2 0,1.27

### Placement (x,y rotation side)
C1  10.67,11.1 90 top
C2  3.81,12.08 180 top
C3  3.81,18.05 180 top
C4  12.26,11.1 90 top
C5  13.85,11.1 90 top
C6  11.43,13.59 180 top
C7  11.43,15.11 180 top
C8  24.51,30.86 90 top
C9  17.02,30.86 270 top
C10  11.81,36.15 0 top
C11  11.81,34.61 0 top
C12  11.81,33.07 0 top
C13  29.97,25.27 0 top
C15  38.86,9.02 0 top
C16  35.69,9.02 180 top
D1  6.95,9.13 0 top
D2  2.03,8.64 180 top
D3  14.72,19.88 270 top
D4  14.72,18.33 270 top
D5  14.72,21.42 90 top
D6  14.72,24.5 90 top
D7  14.72,22.96 90 top
D8  21.46,13.18 0 top
D9  25.15,13.59 90 top
D10  26.67,34.54 90 top
D11  18.54,34.54 90 top
F1  10.69,7.04 180 top
J1  8.52,14.12 90 top
J2  3.15,25.53 0 top
PA1  1.32,35.87 0 top
PC0  1.35,31.3 0 top
PC2  1.35,32.7 0 top
PC11  5.21,27.95 0 top
PC13  9.93,33.1 0 top
R1  3.81,8.64 90 top
R2  15.37,9.27 270 top
R3  18.16,8.51 0 top
R4  18.16,10.03 180 top
R5  11.1,19.88 0 top
R6  11.1,18.33 0 top
R7  2.34,27.03 180 top
R8  24.51,34.29 90 top
R9  11.1,21.42 180 top
R10  11.1,24.5 180 top
R11  11.1,22.96 180 top
R12  18.54,30.86 90 top
R13  21.46,16.89 90 top
R14  26.67,30.86 90 top
R15  29.08,9.02 180 top
S1  21.34,32.38 270 top
S2  29.46,32.38 270 top
U1  5.5,15.1 90 top
U2  17.09,14.3 0 top
U3  1.8,28.5 0 top
U4  25.15,21.84 270 top
X1  13.5,2.09 0 top
X2  28.96,10.22 90 top
X3  37.59,26.54 0 top
X4  19.56,22.35 180 top

### Tracks (layer width: path | path; a pad name or v marks a point on that pad's centre or on a via)
+3V3  (via drill 0.2, 0.35)
  Top 0.152: v1.19,34.7 U3.4 | v1.19,33.79 v1.19,33.8 U3.6 | v1.09,28.84 2.27,28.84 U3.17 | v1.07,29.75 U3.15 | R15.1 v30.99,9.02
  Top 0.203: U2.5 13.84,13.55 | 13.84,13.55 12.27,13.55 C6.1 | U2.6 14.34,13.05 13.84,13.55
  Top 0.254: D6.A D7.A D5.A 15.82,21.46 v16.89,21.46 | R6.1 v10.29,17.25 | D2.A v2.03,10.93 | R4.1 v20.07,10.03 | R12.1 v18.54,28.96 | v27.76,30.07 26.68,30.07 R14.1 | U4.1 27.42,25.15 29.05,25.15 C13.1 v29.17,23.94 v29.18,23.93 | D8.A v21.46,10.95 | J2.1 v1.55,24.46
  Top 0.305: R6.1 R5.1
  Top 0.406: U1.5 4.55,17.99 C3.1 | v12.22,16.41 12.23,16.4 C7.1 C6.1 | v24.51,9.5 D9.2 D9.3 | v38.12,15.77 v38.99,15.77 X2.P4 | v38.12,15.77 37.77,15.77 | 37.34,15.34 37.77,15.77 | 37.34,15.34 37.26,15.34 37.26,9.79 | 37.34,15.34 37.26,15.42 v37.26,15.77 37.77,15.77 | C16.1 37.26,9.79 | 38.04,9.02 37.26,9.79
  Top 0.508: v38.12,15.77 | C15.1 38.04,9.02
  other vias: 5.97,17.92 5.97,18.68 6.73,17.92 6.73,18.68 5.97,19.45 6.73,19.45 7.49,19.45 7.49,18.68 7.49,17.92
  pour Route2: -1,0.5 45.5,0.5 45.5,37 -1,37
  pour Top (no thermals): 4.19,17.62 7.57,17.62 7.77,17.82 7.77,19.55 7.59,19.73 5.87,19.73 5.69,19.55 5.69,18.66 5.49,18.46 4.19,18.46
+5V
  Top 0.203: R2.1 15.84,10.55 U2.7
  Top 0.406: F1.2 8.63,7.04 7.89,7.78 D1.2 8.28,8.41 9.79,8.41 10.67,9.29 C1.1 | C1.1 C4.1 C5.1 15.13,10.3 R2.1 | C1.1 9.91,10.3 9.63,10.58 9.63,11.7 9.23,12.09 8.82,12.09 | 8.33,12.09 8.57,12.09 | 8.57,12.09 8.82,12.09 | 8.33,12.09 4.62,12.09 C2.1 4.55,12.14 U1.1 | 8.57,12.09 8.57,12.33 | 8.57,12.33 8.57,13.3 J1.1 | 8.33,12.09 8.57,12.33 | 8.82,12.09 8.57,12.33
BTN  (via drill 0.2)
  Top 0.152: U3.41 9.39,33.35 9.58,33.53 v9.58,34.25 | D10.1
  Top 0.254: D10.1 26.67,33.37 R14.2 25.91,31.66 25.65,31.41 25.65,30.32 25.4,30.06 C8.1 24.5,30.07 v23.47,30.07 | D10.1 27.11,33.39 28.04,34.32 29.21,34.32 29.46,34.58 S2.1
  Bottom 0.152: v9.58,34.25 19.3,34.25 v23.47,30.07
D+  (via drill 0.2)
  Top 0.152: X1.3 v13.5,7.1 v13.49,7.11 | v6.83,10.62 6.38,10.62 D1.4 6.39,9.83 v6.83,9.83 | U2.3 14.05,14.55 v13.52,15.08
  Bottom 0.152: v6.83,10.62 7.57,10.62 12.04,15.08 v13.52,15.08 | v13.49,7.11 10.29,7.11 7.57,9.83 v6.83,9.83
D-  (via drill 0.2)
  Top 0.152: X1.2 v12.85,7.79 v12.85,7.8 | v8.76,9.8 8.32,9.8 D1.3 8.28,10.62 v8.76,10.62 | v13.52,14.29 13.76,14.05 U2.4
  Bottom 0.152: v12.85,7.8 10.77,7.8 v8.76,9.8 | v13.52,14.29 12.43,14.29 v8.76,10.62
GND  (via drill 0.2, 3.2 pad 4.6)
  Top 0.152: U3.32 9.14,29.3 9.14,28.83 9.14,28.82 U3.31 | U3.60 2.75,36.56 2.82,36.63 3.17,36.63 | 3.17,36.63 3.2,36.61 U3.59 | U3.58 3.65,36.58 3.6,36.63 | 3.6,36.63 3.17,36.63 | U3.57 4.1,36.56 4.02,36.63 3.6,36.63 | U3.84 U3.73 U3.72 U3.83 U3.84 | U3.84 v5.89,33.81
  Top 0.203: U2.25 16.34,15.05 U2.2 14.41,15.05 13.99,15.47 v13.99,15.87
  other vias: 0.66,35.26 4,22 42,34 42,4 4,4 1.27,36.58 17.53,11.43 6.93,12.72 24.26,13.34 24.28,8.4 9.75,28.58 9.5,39 11.5,39 13.5,39 15.5,39 17.5,39 19.5,39 21.5,39 23.5,39 25.5,39 27.5,39 29.5,39 31.5,39 33.5,39 35.5,39 37.5,39 39.5,39 9.5,37 11.5,37 13.5,37 15.5,37 17.5,37 19.5,37 21.5,37 23.5,37 25.5,37 27.5,37 29.5,37 31.5,37 33.5,37 35.5,37 37.5,37 39.5,37 41.5,37 15.5,35 13.5,35 33.5,35 35.5,35 37.5,35 15.5,33 33.5,33 35.5,33 37.5,33 31.5,33 13.5,33 27.5,35 25.5,35 41.5,39 43.5,39 43.5,37 4.82,10.74 17.5,35 17.5,33 19.5,35 19.5,33 21.5,33 23.5,33 23.5,35 31.5,35 29.5,33 27.5,33 25.5,33 14.48,6.35 15.24,6.35 16,6.35 16.76,6.35 17.53,6.35 26.92,13.34 28.19,16.26 28.19,23.62 23.88,20.7 23.11,23.37 18.29,20.19 19.68,16.76 13.21,16.89 5.84,12.72 6.35,26.67 8.89,26.67 9.14,25.4 11.56,29.21 9.75,29.34 0.66,30.4 14.1,31.11 20.07,28.96 27.81,26.54 16.89,25.4 15.11,11.43 33.5,31 37.5,31 39.5,31 31.5,31 35.5,31 17.65,25.4 18.41,25.4 14.73,30.48 15.37,29.84 16,29.21 41.5,31 43.5,31
  pour Top (no thermals): 15.19,5.79 14.66,5.79 14.66,3.41 15.19,3.41
  pour Top (rank 2): -0.5,0.5 45.5,0.5 45.5,39.5 8.1,39.5 8.1,37 -0.5,37
  pour Bottom: -2,0.5 45.5,0.5 45.5,39.5 8.1,39.5 8.1,37 -2,37
  pour Top (no thermals): 38.51,13.94 42.23,13.94 42.23,13.21 38.51,13.21
  pour Route3: -1.5,0.5 45.5,0.5 45.5,39.5 8.1,39.5 8.1,37 -1.5,37
  cutout Top: 2.59,29.13 8.31,29.13 8.31,35.76 2.59,35.76
N$1
  Top 0.254: R1.1 2.28,7.84 D2.C
N$2
  Top 0.305: D3.A R5.2
N$3
  Top 0.152: R4.2 16.84,10.55 U2.9
N$4
  Top 0.152: 24.9,2.13 38.69,2.13 38.69,5.96 24.9,5.96 24.9,2.13
N$5
  Top 0.305: D4.A R6.2
N$6
  Top 0.406: F1.1 11.54,6.96 12.2,6.3 X1.1
N$7
  Top 0.152: U3.8 1.65,32.9 1.45,32.7 PC2.TP
N$8  (via drill 0.2)
  Top 0.152: U2.13 19.79,13.05 19.99,12.85 v19.99,12.32 | v16.87,19.86 15.79,19.86 D3.C
  Bottom 0.152: v19.99,12.32 20.6,12.93 20.6,13.92 17.58,16.94 17.58,19.15 v16.87,19.86
N$9  (via drill 0.2)
  Top 0.152: U2.14 19.88,13.55 v19.89,13.56 | v16.87,18.34 v16.86,18.33 D4.C
  Bottom 0.152: v19.89,13.56 16.87,16.59 v16.87,18.34
N$10
  Top 0.254: U1.3 6.45,14.12 6.93,14.6 8.24,14.6 J1.2
N$11  (via drill 0.2)
  Top 0.152: v1.75,28.09 1.75,27.24 R7.2 | U3.13 1.5,30.65 v1.45,30.6
  Bottom 0.152: v1.75,28.09 1.75,30.3 v1.45,30.6
N$12
  Top 0.152: U4.10 23.52,17.91 23.27,17.65 21.5,17.65 R13.2
N$13
  Top 0.152: PC11.TP 5.21,27.97 5.45,28.21 U3.24
N$14
  Top 0.254: R8.1 C8.2
N$15
  Top 0.305: D6.C R10.1
N$16
  Top 0.305: D7.C R11.1
N$17
  Top 0.305: D5.C R9.1
N$18
  Top 0.254: R13.1 21.46,14.23 D8.C
N$19
  Top 0.152: U3.40 9.65,32.9 9.85,33.1 PC13.TP
N$20
  Top 0.254: R7.1 3.15,27.02 J2.2
N$21
  Top 0.152: PA1.TP 1.59,35.6 U3.2
NRST  (via drill 0.2)
  Top 0.152: U3.10 v1.45,32
  Top 0.254: R12.2 C9.1 17,31.67 v15.88,31.67 | R12.2 D11.1 19.06,33.39 19.99,34.32 21.08,34.32 21.34,34.58 S1.1 | v19.79,31.65 18.55,31.65 R12.2
  Bottom 0.152: v1.45,32 8.13,32 9.04,32.91 12.08,32.91 13.31,31.67 v15.88,31.67 | X3.4 39.24,28.7 22.73,28.7 v19.79,31.65
PA10
  Top 0.152: U3.28 7.25,25.42 8.87,23.8 8.87,21.99 9.44,21.42 R9.2
PA11
  Top 0.152: R10.2 9.26,24.5 8.15,25.61 U3.30
PA12
  Top 0.152: U3.29 7.7,25.52 9.25,23.97 9.25,23.32 9.61,22.96 R11.2
PB10
  Top 0.152: C10.1 11.08,36.08 U3.47
PB11
  Top 0.152: U3.46 9.6,35.6 10.29,34.91 10.7,34.91 C11.1
PC0
  Top 0.152: U3.12 1.62,31.1 1.42,31.3 PC0.TP
PC5
  Top 0.152: C12.1 10.07,34.01 10.07,34.54 9.46,35.15 U3.45
RX  (via drill 0.2)
  Top 0.152: v10.92,32.07 10.66,32.07 10.28,32.45 U3.39 | U2.20 17.84,17.14 21.21,20.5 21.21,21.97 X4.1
  Route3 0.152: v10.92,32.07 10.92,26.8 14.1,23.62 X4.1
SD_CD  (via drill 0.2)
  Top 0.152: U3.35 9.61,30.65 10.03,30.23 12.09,30.23 15.77,26.54 23.75,26.54 v24.18,26.11 | R15.2 28.07,9.23 v28.07,13.66 v28.06,13.66 X2.CD
  Route3 0.152: v24.18,26.11 24.84,26.77 26.31,26.77 27.43,25.65 27.43,14.29 v28.06,13.66
SD_CLK
  Top 0.152: U3.34 9.42,30.2 9.78,29.84 11.81,29.84 15.62,26.04 23.24,26.04 23.52,25.75 U4.7
SD_CLK_BUF  (via drill 0.2)
  Top 0.152: v23.24,11.94 D9.1 v23.24,9.78 | U4.6 24.17,23.41 v24.16,23.39 | X2.P5 38.94,14.67 v38.94,14.66
  Route3 0.152: v24.16,23.39 23.24,22.48 v23.24,11.94
  Bottom 0.152: v23.24,9.78 24.51,11.05 31.5,11.05 35.1,14.66 v38.94,14.66
SD_CS
  Top 0.152: U3.36 9.79,31.1 10.29,30.61 12.32,30.61 15.88,27.05 24.21,27.05 24.82,26.44 U4.5 24.82,22.74 22.87,20.79 U4.9
SD_CS_BUF  (via drill 0.2)
  Top 0.152: v24.51,15.24 D9.7 v24.51,17.4 | v25.48,23.37 U4.4 | X2.P2 38.55,17.97 v38.53,17.96
  Route3 0.152: v24.51,17.4 24.51,21.59 25.48,22.55 v25.48,23.37
  Bottom 0.152: v24.51,15.24 31.62,15.24 34.34,17.96 v38.53,17.96
SD_DI
  Top 0.152: U3.38 10.16,32 10.79,31.37 12.94,31.37 16.24,28.07 25.02,28.07 26.12,26.96 U4.3
SD_DI_BUF  (via drill 0.2)
  Top 0.152: v25.78,14.38 D9.6 v25.78,17.4 | U4.2 v26.77,23.29 | X2.P3 v38.97,16.87 v38.96,16.87
  Route3 0.152: v26.77,23.29 26.77,21.57 25.78,20.57 v25.78,17.4
  Bottom 0.152: v25.78,14.38 31.77,14.38 34.27,16.87 v38.96,16.87
SD_DO  (via drill 0.2)
  Top 0.152: U3.37 9.98,31.55 10.54,30.99 12.63,30.99 16.06,27.56 24.64,27.56 25.48,26.72 v25.48,25.98 | v27.05,9.78 D9.4 v27.05,11.94 | X2.P7 v38.94,12.47
  Route3 0.152: v25.48,25.98 26.14,25.32 26.14,22.07 25.15,21.08 25.15,13.84 v27.05,11.94
  Bottom 0.152: v27.05,9.78 27.69,10.41 31.75,10.41 33.81,12.47 v38.94,12.47
SWCLK  (via drill 0.2)
  Top 0.152: U3.26 6.35,28.44 6.64,28.15 v6.64,27.32
  Bottom 0.152: v6.64,27.32 33.01,27.32 X3.1
SWDIO  (via drill 0.2)
  Top 0.152: U3.25 v5.9,28
  Bottom 0.152: v5.9,28 37.4,28 X3.3
TX  (via drill 0.2)
  Top 0.152: U3.18 2.77,28.8 2.77,28.36 2.96,28.17 3.83,28.17 v5.96,26.04 | U2.21 17.34,17.39 19.55,19.6 X4.2
  Route3 0.152: X4.2 18.41,22.23 13.33,22.23 9.52,26.04 v5.96,26.04
VBUS
  Top 0.203: U2.8 16.34,9.53 R3.1 17.32,8.47 R2.2

### Text on the board
Top: GFB Sensor System / Basestation V1.0 / TU Berlin - 27.10.2022
tNames: RST | BTN | SWCLK | GND | SWDIO | NRST | U3 | RX | TX | EN / 3V3